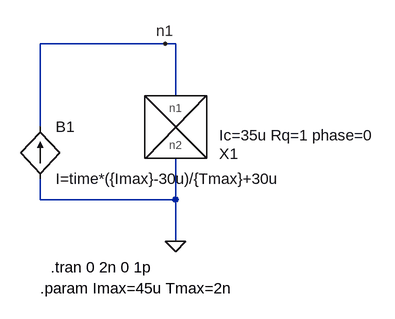
[diagram p0: schematic josephson_junction_test1.asc]
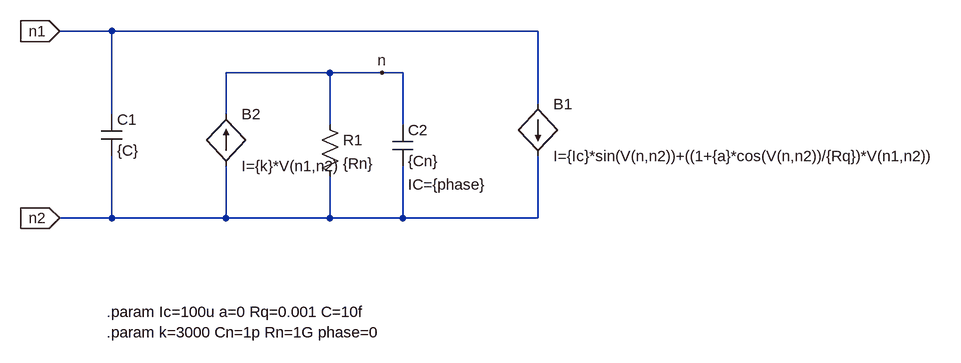
[diagram p1: sub-circuit josephson_junction.asc]
josephson_junction_test1.asc, the LTspice schematic file:
Version 4
SHEET 1 880 680
WIRE 128 384 128 320
WIRE -80 288 -80 320
WIRE -80 320 128 320
WIRE 128 320 128 256
WIRE -80 208 -80 80
WIRE -80 80 112 80
WIRE 128 80 128 160
WIRE 112 80 128 80
FLAG 128 384 0
FLAG 112 80 n1
SYMBOL josephson_junction 128 208 R0
WINDOW 0 67 41 Left 0
WINDOW 39 67 13 Left 0
SYMATTR InstName X1
SYMATTR SpiceLine Ic=35u Rq=1 phase=0
SYMBOL bi2 -80 208 R0
SYMATTR InstName B1
SYMATTR Value I=time*({Imax}-30u)/{Tmax}+30u
TEXT -80 456 Left 0 !.param Imax=45u Tmax=2n
TEXT -64 424 Left 0 !.tran 0 2n 0 1p

josephson_junction.asc, the sub-circuit schematic file:
Version 4
SHEET 1 1360 680
WIRE 16 160 16 32
WIRE 16 32 672 32
WIRE 672 32 672 144
WIRE 16 224 16 320
WIRE 16 320 192 320
WIRE 672 320 672 224
WIRE 16 32 -64 32
WIRE 16 320 -64 320
WIRE 192 240 192 320
WIRE 192 320 352 320
WIRE 192 160 192 96
WIRE 192 96 352 96
WIRE 352 176 352 96
WIRE 352 256 352 320
WIRE 352 320 464 320
WIRE 352 96 432 96
WIRE 464 96 464 176
WIRE 464 240 464 320
WIRE 464 320 672 320
WIRE 432 96 464 96
FLAG -64 32 n1
IOPIN -64 32 In
FLAG -64 320 n2
IOPIN -64 320 In
FLAG 432 96 n
SYMBOL cap 0 160 R0
SYMATTR InstName C1
SYMATTR Value {C}
SYMBOL bi 672 144 R0
SYMATTR InstName B1
SYMATTR Value I={Ic}*sin(V(n,n2))+((1+{a}*cos(V(n,n2))/{Rq})*V(n1,n2))
SYMBOL bi2 192 160 R0
SYMATTR InstName B2
SYMATTR Value I={k}*V(n1,n2)
SYMBOL res 336 160 R0
SYMATTR InstName R1
SYMATTR Value {Rn}
SYMBOL cap 448 176 R0
WINDOW 123 24 92 Left 0
SYMATTR Value2 IC={phase}
SYMATTR InstName C2
SYMATTR Value {Cn}
TEXT 8 464 Left 0 !.param Ic=100u a=0 Rq=0.001 C=10f
TEXT 8 496 Left 0 !.param k=3000 Cn=1p Rn=1G phase=0

The netlist it stands for:
* josephson_junction_test1.asc
XX1 n1 0 josephson_junction params: Ic=35u Rq=1 phase=0
B1 0 n1 I=time*({Imax}-30u)/{Tmax}+30u

* block symbol definitions
.subckt josephson_junction n1 n2
C1 n1 n2 {C}
B1 n1 n2 I={Ic}*sin(V(n,n2))+((1+{a}*cos(V(n,n2))/{Rq})*V(n1,n2))
B2 n2 n I={k}*V(n1,n2)
R1 n n2 {Rn}
C2 n n2 {Cn} IC={phase}
.param Ic=100u a=0 Rq=0.001 C=10f
.param k=3000 Cn=1p Rn=1G phase=0
.ends josephson_junction

.param Imax=45u Tmax=2n
.tran 0 2n 0 1p
.backanno
.end